# Altium schematic sheet ADSP_1.SchDoc
size A4
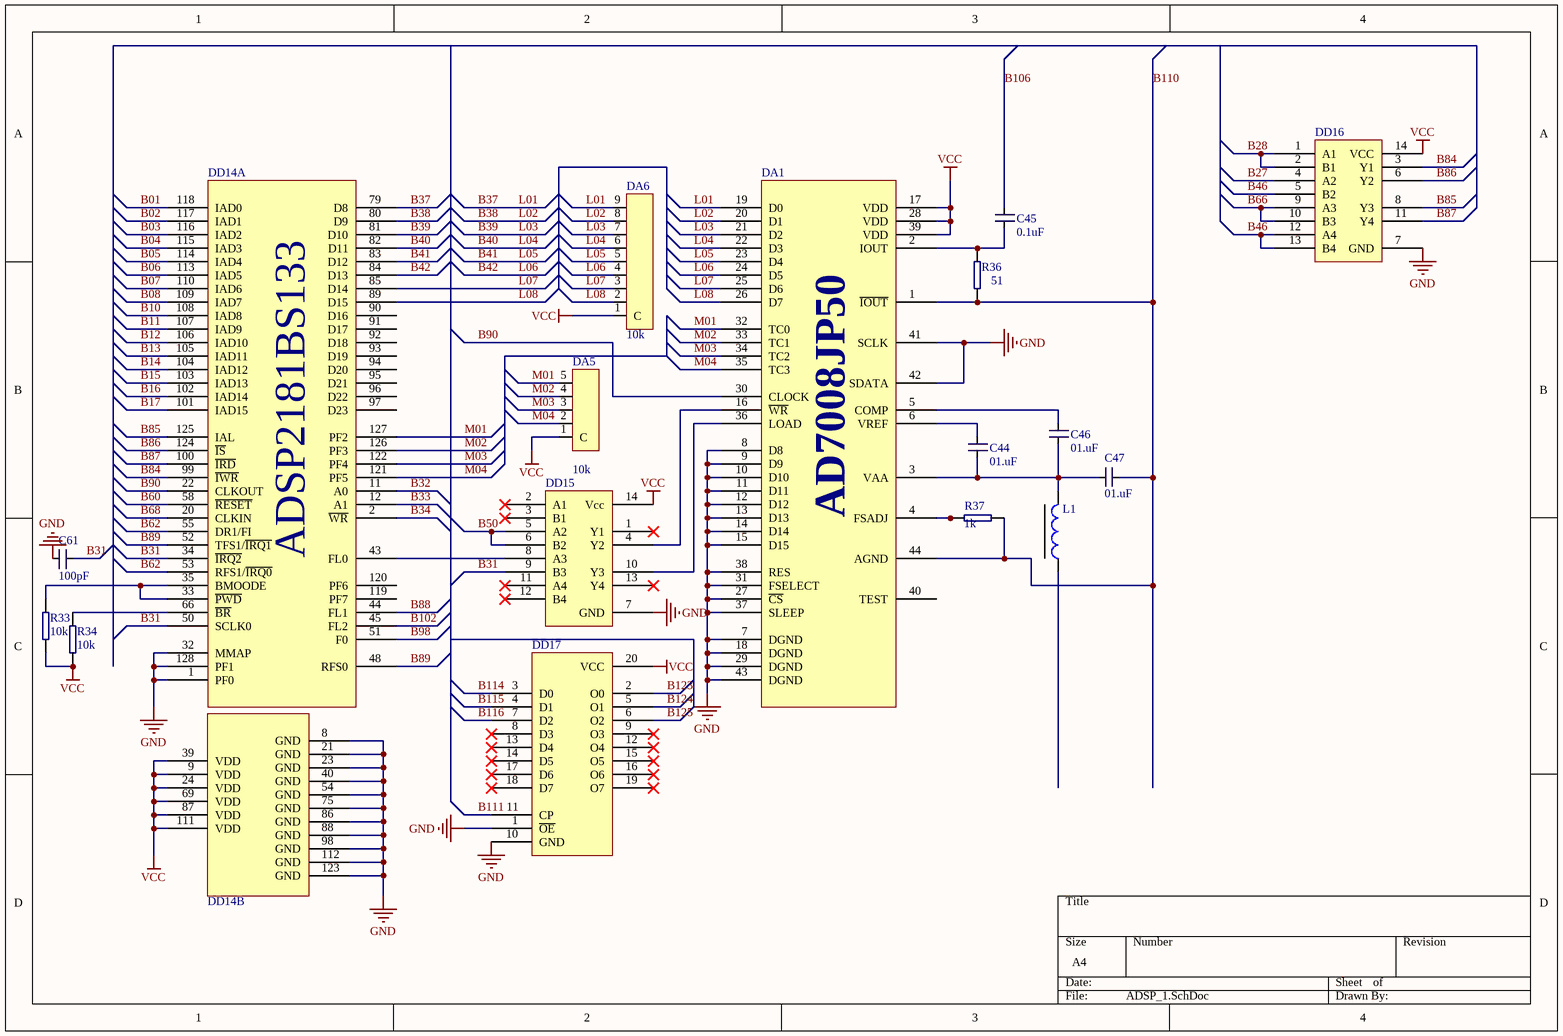
[diagram p0: ADSP_1.SchDoc]

## Parts
C44  value 01.uF  [0805]  (hidden comment: Cap)
C45  value 0.1uF  [0805]  (hidden comment: Cap)
C46  value 01.uF  [0805]  (hidden comment: Cap)
C47  value 01.uF  [0805]  (hidden comment: Cap)
C61  value 100pF  [0805]  (hidden comment: Cap)
DA1  AD7008JP50  [44 PLCC]  (value not drawn)
DA5  value 10k  [SIP5]  (hidden comment: 5A103J)
DA6  value 10k  [SIP9]  (hidden comment: 9A103J)
DD14  ADSP2181BS1332  [128 PQFP]  (value not drawn)  (parts A,B of 2)
DD15  IN74AC02D  [14 SOIC-3.9]  (value not drawn)
DD16  IN74AC08D  [14 TSSOP-4.4]  (value not drawn)
DD17  SN74AC374D  [20 SOIC-7.5]  (value not drawn)
L1  L  [E(1820)]  (value not drawn)
R33  value 10k  [0805]  (hidden comment: R)
R34  value 10k  [0805]  (hidden comment: R)
R36  value 51  [0805]  (hidden comment: R)
R37  value 1k  [0805]  (hidden comment: R)

## Nets
GND: C61.1 DA1.7(DGND) DA1.8(D8) DA1.9(D9) DA1.10(D10) DA1.11(D11) DA1.12(D12) DA1.13(D13) DA1.14(D14) DA1.15(D15) DA1.18(DGND) DA1.27(~{CS}) DA1.29(DGND) DA1.31(FSELECT) DA1.37(SLEEP) DA1.38(RES) DA1.41(SCLK) DA1.42(SDATA) DA1.43(DGND) DD14.1(PF0) DD14.8(GND) DD14.21(GND) DD14.23(GND) DD14.32(MMAP) DD14.40(GND) DD14.54(GND) DD14.75(GND) DD14.86(GND) DD14.88(GND) DD14.98(GND) DD14.112(GND) DD14.123(GND) DD14.128(PF1) DD15.7(GND) DD16.7(GND) DD17.1(~{OE}) DD17.10(GND)
VCC: DA1.17(VDD) DA1.28(VDD) DA1.39(VDD) DA5.1(C) DA6.1(C) DD14.9(VDD) DD14.24(VDD) DD14.39(VDD) DD14.69(VDD) DD14.87(VDD) DD14.111(VDD) DD15.14(Vcc) DD16.14(VCC) DD17.20(VCC) R33.1 R34.1
B01: DD14.118(IAD0)
B02: DD14.117(IAD1)
B03: DD14.116(IAD2)
B04: DD14.115(IAD3)
B05: DD14.114(IAD4)
B06: DD14.113(IAD5)
B07: DD14.110(IAD6)
B08: DD14.109(IAD7)
B10: DD14.108(IAD8)
B11: DD14.107(IAD9)
B12: DD14.106(IAD10)
B13: DD14.105(IAD11)
B14: DD14.104(IAD12)
B15: DD14.103(IAD13)
B16: DD14.102(IAD14)
B17: DD14.101(IAD15)
B27: DD16.4(A2)
B28: DD16.1(A1) DD16.2(B1)
B31: C61.2 DD14.34(~{IRQ2}) DD14.50(SCLK0) DD15.9(B3)
B32: DD14.11(A0)
B33: DD14.12(A1)
B34: DD14.2(~{WR})
B37: DA1.19(D0) DA6.9 DD14.79(D8)  [also labelled L01]
B38: DA1.20(D1) DA6.8 DD14.80(D9)  [also labelled L02]
B39: DA1.21(D2) DA6.7 DD14.81(D10)  [also labelled L03]
B40: DA1.22(D3) DA6.6 DD14.82(D11)  [also labelled L04]
B41: DA1.23(D4) DA6.5 DD14.83(D12)  [also labelled L05]
B42: DA1.24(D5) DA6.4 DD14.84(D13)  [also labelled L06]
B46: DD16.5(B2) DD16.12(A4) DD16.13(B4)
B50: DD15.5(A2) DD15.6(B2)
B60: DD14.58(~{RESET})
B62: DD14.53(RFS1/~{IRQ0}) DD14.55(DR1/FI)
B66: DD16.9(A3) DD16.10(B3)
B68: DD14.20(CLKIN)
B84: DD14.99(~{IWR}) DD16.3(Y1)
B85: DD14.125(IAL) DD16.8(Y3)
B86: DD14.124(~{IS}) DD16.6(Y2)
B87: DD14.100(~{IRD}) DD16.11(Y4)
B88: DD14.44(FL1)
B89: DD14.48(RFS0) DD14.52(TFS1/~{IRQ1})
B90: DA1.30(CLOCK) DD14.22(CLKOUT)
B98: DD14.51(F0)
B102: DD14.45(FL2)
B106: C45.2
B110: C47.1 DA1.1(~{IOUT}) DA1.44(AGND) R36.1 R37.2
B111: DD17.11(CP)
B114: DD17.3(D0)
B115: DD17.4(D1)
B116: DD17.7(D2)
B123: DD17.2(O0)
B124: DD17.5(O1)
B125: DD17.6(O2)
L07: DA1.25(D6) DA6.3 DD14.85(D14)
L08: DA1.26(D7) DA6.2 DD14.89(D15)
M01: DA1.32(TC0) DA5.5 DD14.127(PF2)
M02: DA1.33(TC1) DA5.4 DD14.126(PF3)
M03: DA1.34(TC2) DA5.3 DD14.122(PF4)
M04: DA1.35(TC3) DA5.2 DD14.121(PF5)
NetC44_1: C44.1 C46.1 C47.2 DA1.3(VAA) L1.2
NetC44_2: C44.2 DA1.6(VREF)
NetC45_1: C45.1 DA1.2(IOUT) R36.2
NetC46_2: C46.2 DA1.5(COMP)
NetDA1_4: DA1.4(FSADJ) R37.1
NetDA1_16: DA1.16(~{WR}) DD15.4(Y2)
NetDA1_36: DA1.36(LOAD) DD15.10(Y3)
NetDD14_33: DD14.33(~{PWD}) DD14.35(BMOODE) R33.2
NetDD14_43: DD14.43(FL0) DD15.8(A3)
NetDD14_66: DD14.66(~{BR}) R34.2

Not connected (* = marked no-connect by the designer): DA1 40(TEST); DD14 90(D16) 91(D17) 92(D18) 93(D19) 94(D20) 95(D21) 96(D22) 97(D23) 119(PF7) 120(PF6); DD15 1(Y1)* 2(A1)* 3(B1)* 11(A4)* 12(B4)* 13(Y4)*; DD17 8(D3)* 9(O3)* 12(O4)* 13(D4)* 14(D5)* 15(O5)* 16(O6)* 17(D6)* 18(D7)* 19(O7)*; L1 1

## Notes on the sheet
- (in symbol ADSP2181BS1332, part A) ADSP2181BS133